# Altium schematic sheet HPF.SchDoc
size 431 x 279 mm
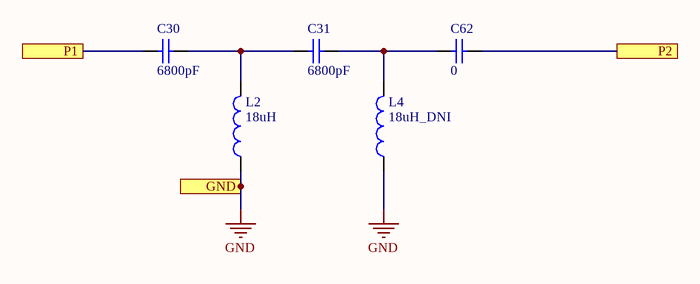
[diagram p0: HPF.SchDoc]

## Parts
C30  6800pF  [SMD-0603]
C31  6800pF  [SMD-0603]
C62  0  [SMD-0603]
L2  18uH  [SMD-0603]
L4  18uH_DNI  [SMD-0603]

## Ports
GND, P1, P2

## Nets
GND: L2.1 L4.1 ; port GND
P1: C30.1 ; port P1
P2: C62.2 ; port P2
NetC30_2: C30.2 C31.1 L2.2
NetC31_2: C31.2 C62.1 L4.2

## Notes on the sheet
- DWG. NO.
- REV.
- SHT.
- THIS DOCUMENT AND THE DATA DISCLOSED HEREIN OR HEREWITH IS THE PROPERTY OF ALTIUM LIMITED AND MAY BE FREELY DISTRIBUTED IN WHOLE. NO RIGHTS ARE RESERVED OR EXPRESS OR IMPLIED WARANTEE GIVEN.
- REVISION
- DESCRIPTION
- DATE
- APPROVED
- ENG:
- APPROVALS
- PROJECT
- DSN:
- CHK:
- REFERENCE DOCUMENTS
- PROJECT REVISION:
- TITLE
- DOCUMENT REVISION:
- DESIGN ITEM:
- BOM:
- FAB DWG:
- PCB DWG:
- ASSY DWG:
- SCALE:
- SIZE
- B
- CAGE CODE
- FILE NAME
- DWG NO.
- SHEET
- OF
- REV

## Library data of the parts
C30 C31 C62 = CAP0603: Ceramic Capacitor 0603
L2 L4 = L0603: Inductor 0603